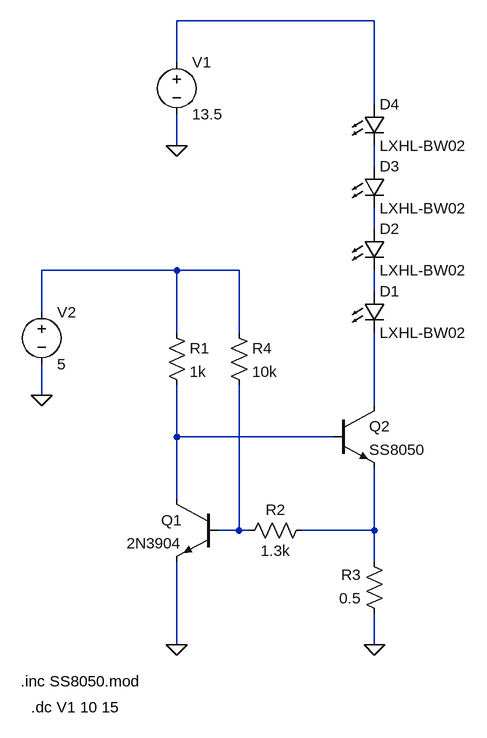
[diagram p0: schematic high_current_low_dropout.asc]
high_current_low_dropout.asc, the LTspice schematic file:
Version 4
SHEET 1 880 752
WIRE -544 -320 -848 -320
WIRE -848 -256 -848 -320
WIRE -544 -192 -544 -320
WIRE -848 -128 -848 -176
WIRE -544 -96 -544 -128
WIRE -544 0 -544 -32
WIRE -848 64 -1056 64
WIRE -752 64 -848 64
WIRE -544 96 -544 64
WIRE -1056 128 -1056 64
WIRE -848 160 -848 64
WIRE -752 160 -752 64
WIRE -1056 256 -1056 208
WIRE -544 272 -544 160
WIRE -848 320 -848 240
WIRE -608 320 -848 320
WIRE -848 416 -848 320
WIRE -752 464 -752 240
WIRE -752 464 -784 464
WIRE -736 464 -752 464
WIRE -544 464 -544 368
WIRE -544 464 -656 464
WIRE -544 512 -544 464
WIRE -848 640 -848 512
WIRE -544 640 -544 592
FLAG -848 640 0
FLAG -544 640 0
FLAG -848 -128 0
FLAG -1056 256 0
SYMBOL res -864 144 R0
SYMATTR InstName R1
SYMATTR Value 1k
SYMBOL npn -784 416 M0
SYMATTR InstName Q1
SYMATTR Value 2N3904
SYMBOL npn -608 272 R0
SYMATTR InstName Q2
SYMATTR Value SS8050
SYMBOL res -640 448 R90
WINDOW 0 0 56 VBottom 2
WINDOW 3 32 56 VTop 2
SYMATTR InstName R2
SYMATTR Value 1.3k
SYMBOL res -528 608 R180
WINDOW 0 36 76 Left 2
WINDOW 3 36 40 Left 2
SYMATTR InstName R3
SYMATTR Value 0.5
SYMBOL LED -560 96 R0
SYMATTR InstName D1
SYMATTR Value LXHL-BW02
SYMBOL voltage -848 -272 R0
SYMATTR InstName V1
SYMATTR Value 13.5
SYMBOL LED -560 0 R0
SYMATTR InstName D2
SYMATTR Value LXHL-BW02
SYMBOL LED -560 -96 R0
SYMATTR InstName D3
SYMATTR Value LXHL-BW02
SYMBOL LED -560 -192 R0
SYMATTR InstName D4
SYMATTR Value LXHL-BW02
SYMBOL voltage -1056 112 R0
SYMATTR InstName V2
SYMATTR Value 5
SYMBOL res -768 144 R0
SYMATTR InstName R4
SYMATTR Value 10k
TEXT -1088 696 Left 2 !.inc SS8050.mod
TEXT -1072 736 Left 2 !.dc V1 10 15

The netlist it stands for:
* high_current_low_dropout.asc
R1 N004 N007 1k
Q1 N007 N008 0 0 2N3904
Q2 N006 N007 N009 0 SS8050
R2 N009 N008 1.3k
R3 0 N009 0.5
D1 N005 N006 LXHL-BW02
V1 N001 0 13.5
D2 N003 N005 LXHL-BW02
D3 N002 N003 LXHL-BW02
D4 N001 N002 LXHL-BW02
V2 N004 0 5
R4 N004 N008 10k
.model D D
.lib standard.dio
.model NPN NPN
.model PNP PNP
.lib standard.bjt
.inc SS8050.mod
.dc V1 10 15
.backanno
.end